# EAGLE design tivac-shield-communication (EAGLE 9.5.2)
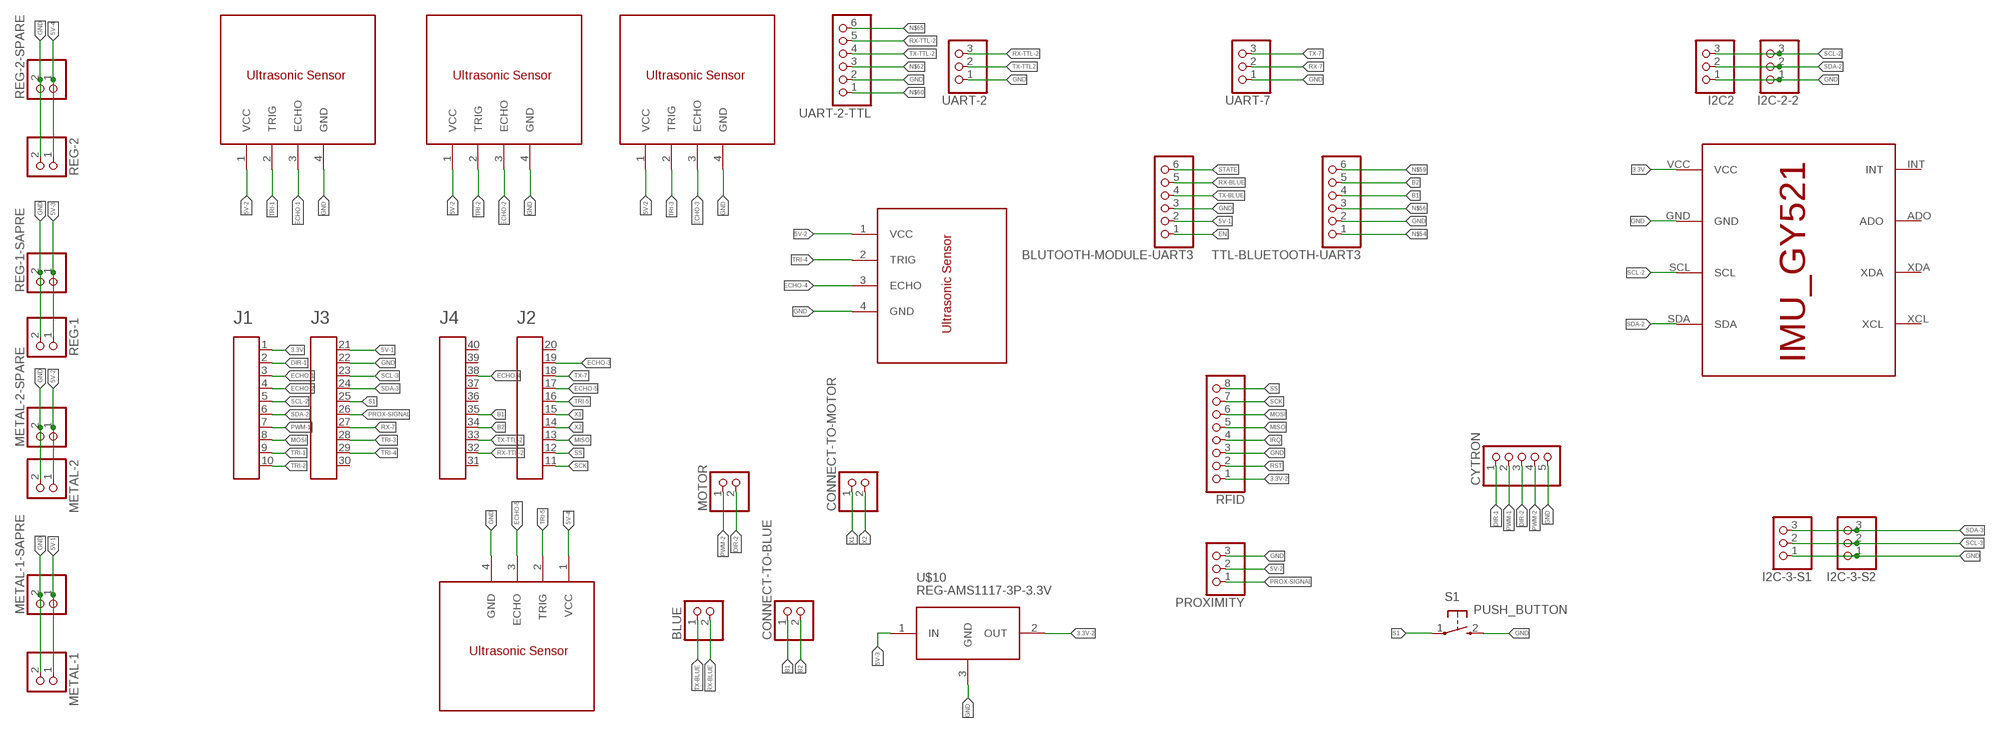
[diagram p0: schematic, sheet 1]

## Parts
A1  HEADER4X10-BOOSTERPACK  [4X10-BOOSTERPACK]
BLUE  PINHD-2_DATA  [1X02_DATA]
BLUTOOTH-MODULE-UART3  PINHD-1X6  [1X06]
CONNECT-TO-BLUE  PINHD-2_DATA  [1X02_DATA]
CONNECT-TO-MOTOR  PINHD-2_DATA  [1X02_DATA]
CYTRON  PINHD-5_DATA  [1X05_DATA]
I2C2  PINHD-1X3  [1X03]
I2C-2-2  PINHD-1X3  [1X03]
I2C-3-S1  PINHD-1X3  [1X03]
I2C-3-S2  PINHD-1X3  [1X03]
METAL-1  PINHD-1X2  [1X02]
METAL-1-SAPRE  PINHD-1X2  [1X02]
METAL-2  PINHD-1X2  [1X02]
METAL-2-SPARE  PINHD-1X2  [1X02]
MOTOR  PINHD-2_DATA  [1X02_DATA]
PROXIMITY  PINHD-1X3  [1X03]
REG-1  PINHD-1X2  [1X02]
REG-1-SAPRE  PINHD-1X2  [1X02]
REG-2  PINHD-1X2  [1X02]
REG-2-SPARE  PINHD-1X2  [1X02]
RFID  PINHD-1X8  [1X08]
S1  PUSH_BUTTON  [B3F-10XX]
TTL-BLUETOOTH-UART3  PINHD-6_DATA  [1X06_DATA]
U$1  ULTRASONIC_SENSOR  [1X04]
U$2  ULTRASONIC_SENSOR  [1X04]
U$3  ULTRASONIC_SENSOR  [1X04]
U$5  ULTRASONIC_SENSOR  [1X04]
U$7  ULTRASONIC_SENSOR  [1X04]
U$9  IMU_ROBOCON  [IMU_GY521]
U$10  REG-AMS1117-3P-3.3V  [REG-AMS1117-3P]
UART-2  PINHD-1X3  [1X03]
UART-2-TTL  PINHD-6_DATA  [1X06_DATA]
UART-7  PINHD-1X3  [1X03]

## Nets
3.3V: A1.1 U$9.VCC
3.3V-2: RFID.1 U$10.2(OUT)
5V-1: A1.21 BLUTOOTH-MODULE-UART3.2 METAL-1-SAPRE.1 METAL-1.1
5V-2: METAL-2-SPARE.1 METAL-2.1 PROXIMITY.2 U$1.1(VCC) U$2.1(VCC) U$3.1(VCC) U$7.1(VCC)
5V-3: REG-1-SAPRE.1 REG-1.1 U$10.1(IN)
5V-4: REG-2-SPARE.1 REG-2.1 U$5.1(VCC)
B1: A1.35 CONNECT-TO-BLUE.1 TTL-BLUETOOTH-UART3.4
B2: A1.34 CONNECT-TO-BLUE.2 TTL-BLUETOOTH-UART3.5
DIR-1: A1.2 CYTRON.1
DIR-2: CYTRON.3 MOTOR.2
ECHO-1: A1.3 U$1.3(ECHO)
ECHO-2: A1.4 U$2.3(ECHO)
ECHO-3: A1.19 U$3.3(ECHO)
ECHO-4: A1.38 U$7.3(ECHO)
ECHO-5: A1.17 U$5.3(ECHO)
EN: BLUTOOTH-MODULE-UART3.1
GND: A1.22 BLUTOOTH-MODULE-UART3.3 CYTRON.5 I2C2.1 I2C-2-2.1 I2C-3-S1.1 I2C-3-S2.1 METAL-1-SAPRE.2 METAL-1.2 METAL-2-SPARE.2 METAL-2.2 PROXIMITY.3 REG-1-SAPRE.2 REG-1.2 REG-2-SPARE.2 REG-2.2 RFID.3 S1.2(S) TTL-BLUETOOTH-UART3.2 U$1.4(GND) U$2.4(GND) U$3.4(GND) U$5.4(GND) U$7.4(GND) U$9.GND U$10.3(GND) UART-2-TTL.2 UART-2.1 UART-7.1
IRQ: RFID.4
MISO: A1.13 RFID.5
MOSI: A1.8 RFID.6
N$54: TTL-BLUETOOTH-UART3.1
N$56: TTL-BLUETOOTH-UART3.3
N$59: TTL-BLUETOOTH-UART3.6
N$60: UART-2-TTL.1
N$62: UART-2-TTL.3
N$65: UART-2-TTL.6
PROX-SIGNAL: A1.26 PROXIMITY.1
PWM-1: A1.7 CYTRON.2
PWM-2: CYTRON.4 MOTOR.1
RST: RFID.2
RX-7: A1.27 UART-7.2
RX-BLUE: BLUE.2 BLUTOOTH-MODULE-UART3.5
RX-TTL-2: A1.32 UART-2-TTL.5 UART-2.3
S1: A1.25 S1.1(P)
SCK: A1.11 RFID.7
SCL-2: A1.5 I2C2.3 I2C-2-2.3 U$9.SCL
SCL-3: A1.23 I2C-3-S1.2 I2C-3-S2.2
SDA-2: A1.6 I2C2.2 I2C-2-2.2 U$9.SDA
SDA-3: A1.24 I2C-3-S1.3 I2C-3-S2.3
SS: A1.12 RFID.8
STATE: BLUTOOTH-MODULE-UART3.6
TRI-1: A1.9 U$1.2(TRIG)
TRI-2: A1.10 U$2.2(TRIG)
TRI-3: A1.28 U$3.2(TRIG)
TRI-4: A1.29 U$7.2(TRIG)
TRI-5: A1.16 U$5.2(TRIG)
TX-7: A1.18 UART-7.3
TX-BLUE: BLUE.1 BLUTOOTH-MODULE-UART3.4
TX-TTL2: UART-2.2
TX-TTL-2: A1.33 UART-2-TTL.4
X1: A1.15 CONNECT-TO-MOTOR.1
X2: A1.14 CONNECT-TO-MOTOR.2
Unconnected: A1.20 A1.30 A1.31 A1.36 A1.37 A1.39 A1.40 U$9.ADO U$9.INT U$9.XCL U$9.XDA

## Library data of the parts
A1 = EAGLE_BoosterPack_Library:HEADER4X10-BOOSTERPACK
BLUE CONNECT-TO-BLUE CONNECT-TO-MOTOR MOTOR = MIA_LIBRARY-2-2-2 (1):PINHD-2_DATA: PIN HEADER
BLUTOOTH-MODULE-UART3 = MIA_LIBRARY-2-2-2 (1):PINHD-1X6: PIN HEADER
CYTRON = MIA_LIBRARY-2-2-2 (1):PINHD-5_DATA: PIN HEADER
I2C2 I2C-2-2 I2C-3-S1 I2C-3-S2 PROXIMITY UART-2 UART-7 = MIA_LIBRARY-2-2-2 (1):PINHD-1X3: PIN HEADER
METAL-1 METAL-1-SAPRE METAL-2 METAL-2-SPARE REG-1 REG-1-SAPRE REG-2 REG-2-SPARE = MIA_LIBRARY-2-2-2 (1):PINHD-1X2: PIN HEADER
RFID = MIA_LIBRARY-2-2-2 (1):PINHD-1X8: PIN HEADER
S1 = MIA_LIBRARY-2-2-2 (1):PUSH_BUTTON: OMRON SWITCH
TTL-BLUETOOTH-UART3 UART-2-TTL = MIA_LIBRARY-2-2-2 (1):PINHD-6_DATA: PIN HEADER
U$1-U$3 U$5 U$7 = MIA_LIBRARY-2-2-2 (1):ULTRASONIC_SENSOR
U$9 = MIA_LIBRARY-2-2-2 (1):IMU_ROBOCON
U$10 = MIA_LIBRARY-2-2-2 (1):REG-AMS1117-3P-*: Linear Regulator based on AMS1117 chip 3-pin version AMS1117 datasheet is available here: http://www.advanced-monolithic.com/pdf/ds1117.pdf Click here to find device on ebay.com <http://www.ebay.com/sch/ams1117+module> Note: There are many variants. Search for the proper version.

## Board
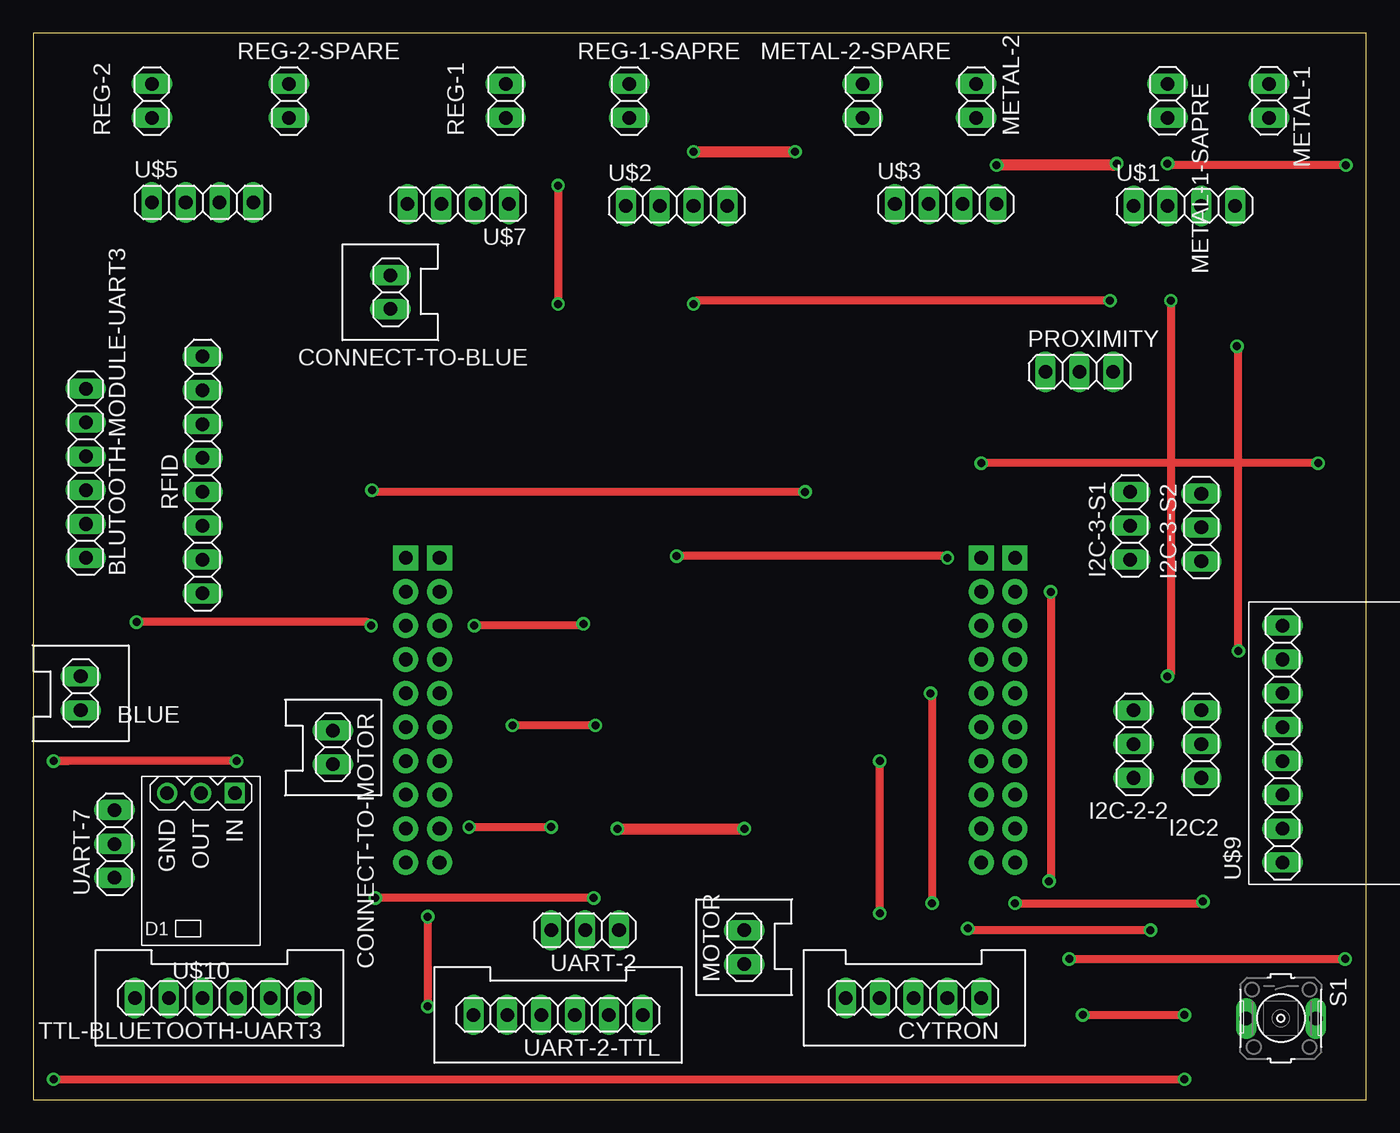
[diagram p1: board, top side]
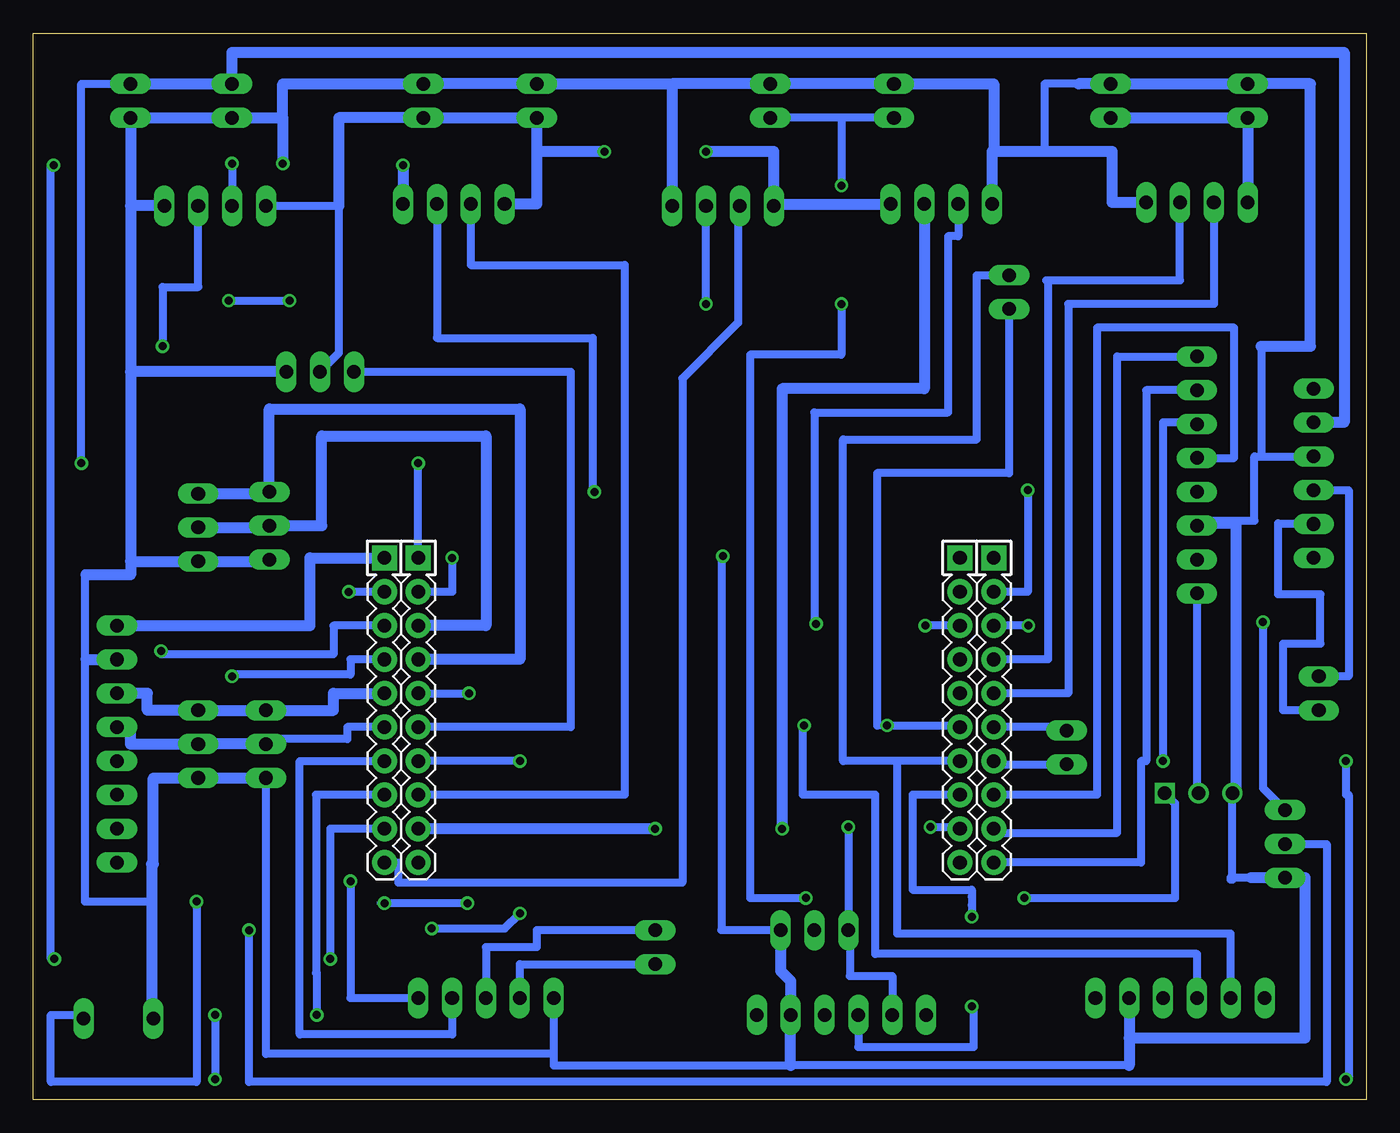
[diagram p2: board, bottom side, seen from below]

Size 100 x 80 mm. Coordinates in mm from the lower left corner, seen from the top.
Outline: 0,0 100,0 100,80 0,80 0,0
Copper layers (1*16): Top 0.035mm / dielectric 1.5mm / Bottom 0.035mm
Design rules "default": minimum track width 6mil, minimum drill 0.35mm, track to track 6mil, track to pad 6mil, pad to pad 6mil, via to via 6mil, smd to smd 6mil, copper to edge 40mil, drill to drill 6mil, minimum pad ring 10mil, minimum via ring 8mil, stop-mask expansion 4mil, vias tented up to drill 0mil, thermal gap 10mil

### Footprints (pad centres in the part's own frame; a part is rotated, then mirrored left to right if it is on the bottom)
4X10-BOOSTERPACK = drill 1.016 pad 1.88 square: 1 0,10.16; 20 45.72,10.16; 21 2.54,10.16; 40 43.18,10.16 | drill 1.016 pad 1.88: 2 0,7.62; 3 0,5.08; 4 0,2.54; 5 0,0; 6 0,-2.54; 7 0,-5.08; 8 0,-7.62; 9 0,-10.16; 10 0,-12.7; 11 45.72,-12.7; 12 45.72,-10.16; 13 45.72,-7.62; 14 45.72,-5.08; 15 45.72,-2.54; 16 45.72,0; 17 45.72,2.54; 18 45.72,5.08; 19 45.72,7.62; 22 2.54,7.62; 23 2.54,5.08; 24 2.54,2.54; 25 2.54,0; 26 2.54,-2.54; 27 2.54,-5.08; 28 2.54,-7.62; 29 2.54,-10.16; 30 2.54,-12.7; 31 43.18,-12.7; 32 43.18,-10.16; 33 43.18,-7.62; 34 43.18,-5.08; 35 43.18,-2.54; 36 43.18,0; 37 43.18,2.54; 38 43.18,5.08; 39 43.18,7.62
1X02_DATA = drill 1.016 long: 1 -1.27,0; 2 1.27,0
1X06 = drill 1.016 long: 1 -6.35,0; 2 -3.81,0; 3 -1.27,0; 4 1.27,0; 5 3.81,0; 6 6.35,0
1X05_DATA = drill 1.016 long: 1 -5.08,0; 2 -2.54,0; 3 0,0; 4 2.54,0; 5 5.08,0
1X03 = drill 1.016 long: 1 -2.54,0; 2 0,0; 3 2.54,0
1X02 = drill 1.016 long: 1 -1.27,0; 2 1.27,0
1X08 = drill 1.016 long: 1 -8.89,0; 2 -6.35,0; 3 -3.81,0; 4 -1.27,0; 5 1.27,0; 6 3.81,0; 7 6.35,0; 8 8.89,0
B3F-10XX = drill 1.016 long: 1 0.013,2.636; 2 0.029,-2.605
1X06_DATA = drill 1.016 long: 1 -6.35,0; 2 -3.81,0; 3 -1.27,0; 4 1.27,0; 5 3.81,0; 6 6.35,0
1X04 = drill 1.016 long: 1 -3.81,0; 2 -1.27,0; 3 1.27,0; 4 3.81,0
IMU_GY521 = drill 1.016 long: ADO -6.35,0; GND 6.35,0; INT -8.89,0; SCL 3.81,0; SDA 1.27,0; VCC 8.89,0; XCL -3.81,0; XDA -1.27,0
REG-AMS1117-3P = drill 1 square: 1 -2.54,-5.08 | drill 1: 2 0,-5.08; 3 2.54,-5.08

### Placement (x,y rotation side)
A1  73.66,30.48 0 bottom
BLUE  3.56,30.48 270 top
BLUTOOTH-MODULE-UART3  3.94,46.99 270 top
CONNECT-TO-BLUE  26.8,60.58 90 top
CONNECT-TO-MOTOR  22.48,26.42 270 top
CYTRON  66.04,7.62 180 top
I2C2  87.63,26.67 90 top
I2C-2-2  82.55,26.67 90 top
I2C-3-S1  82.3,43.05 90 top
I2C-3-S2  87.63,42.93 90 top
METAL-1  92.71,74.93 270 top
METAL-1-SAPRE  85.09,74.93 270 top
METAL-2  70.74,74.93 90 top
METAL-2-SPARE  62.23,74.93 90 top
MOTOR  53.34,11.43 90 top
PROXIMITY  78.49,54.61 0 top
REG-1  35.43,74.93 90 top
REG-1-SAPRE  44.7,74.93 90 top
REG-2  8.89,74.93 90 top
REG-2-SPARE  19.18,74.93 90 top
RFID  12.7,46.86 90 top
S1  93.6,6.1 270 top
TTL-BLUETOOTH-UART3  13.97,7.62 180 top
U$1  86.36,67.06 0 top
U$2  48.26,67.06 0 top
U$3  68.45,67.18 0 top
U$5  12.7,67.31 0 top
U$7  31.88,67.18 180 top
U$9  93.73,26.67 90 top
U$10  12.57,17.91 180 top
UART-2  41.4,12.7 180 top
UART-2-TTL  39.37,6.35 180 top
UART-7  6.1,19.18 90 top

### Tracks (layer width: path | path; a pad name or v marks a point on that pad's centre or on a via)
3.3V
  Bottom 0.813: U$9.VCC 79.25,35.56 79.25,40.64 A1.1
3.3V-2
  Bottom 0.61: RFID.1 12.7,23.11 U$10.2
5V-1  (via drill 0.6)
  Top 0.61: v96.39,47.75 v71.12,47.75
  Bottom 0.61: A1.21 v71.12,47.75 | v96.39,47.75 96.39,76.2 METAL-1.1
  Bottom 0.813: METAL-1.1 METAL-1-SAPRE.1 85.09,78.58 1.65,78.58 1.65,50.8 BLUTOOTH-MODULE-UART3.2
5V-2  (via drill 0.6)
  Top 0.813: v49.53,71.12 v57.15,71.12
  Bottom 0.61: PROXIMITY.2 77.09,56.01 77.09,67.06 U$1.1
  Bottom 0.813: 77.09,67.06 77.09,73.66 METAL-2.1 METAL-2-SPARE.1 62.23,71.12 | 62.23,71.12 62.23,67.18 U$3.1 | U$7.1 44.32,67.18 U$2.1 44.45,71.12 v49.53,71.12 | v57.15,71.12 62.23,71.12
5V-3  (via drill 0.6)
  Top 0.61: v39.37,68.58 v39.37,59.69 | v42.04,15.11 v25.65,15.11
  Bottom 0.61: REG-1-SAPRE.1 REG-1.1 39.37,73.66 v39.37,68.58 | v42.04,15.11 46.23,15.11 46.23,55.88 39.37,55.88 v39.37,59.69 | v25.65,15.11 14.35,15.11 14.35,22.23 U$10.1
5V-4
  Bottom 0.813: REG-2-SPARE.1 REG-2.1 U$5.1
B1  (via drill 0.6)
  Top 0.61: v42.16,28.07 v35.94,28.07
  Bottom 0.61: CONNECT-TO-BLUE.1 26.8,46.99 36.7,46.99 36.7,28.07 v35.94,28.07 30.61,28.07 A1.35 | TTL-BLUETOOTH-UART3.4 12.7,10.92 36.83,10.92 36.83,22.86 42.29,22.86 42.29,27.94 v42.16,28.07
B2
  Bottom 0.61: A1.34 35.18,25.4 | 35.18,25.4 39.24,25.4 39.24,49.53 29.21,49.53 29.21,61.85 CONNECT-TO-BLUE.2 | TTL-BLUETOOTH-UART3.5 10.16,12.45 35.18,12.45 35.18,25.4
DIR-1  (via drill 0.6)
  Top 0.61: v76.33,38.1 76.33,16.51 76.2,16.51 v76.2,16.38
  Bottom 0.61: A1.2 v76.33,38.1 | v76.2,16.38 76.2,7.62 CYTRON.1
DIR-2
  Bottom 0.61: MOTOR.2 62.23,12.7 62.23,11.43 66.04,11.43 CYTRON.3
ECHO-1  (via drill 0.6)
  Top 0.61: v90.42,33.66 90.42,56.52 v90.3,56.52
  Bottom 0.61: U$1.3 87.63,60.96 90.3,60.96 v90.3,56.52 | A1.3 77.47,35.56 77.47,33.4 90.42,33.4 v90.42,33.66
ECHO-2  (via drill 0.6)
  Top 0.61: v85.34,59.94 85.34,32 v85.09,31.75 | v80.77,59.94 49.78,59.94 v49.53,59.69
  Bottom 0.61: A1.4 76.2,33.02 76.2,31.88 85.09,31.88 v85.09,31.75 | v85.34,59.94 v80.77,59.94 | v49.53,59.69 U$2.3
ECHO-3  (via drill 0.6)
  Top 0.61: v57.91,45.59 25.53,45.59 v25.4,45.72
  Bottom 0.61: U$3.3 69.72,57.15 58.04,57.15 58.04,45.72 v57.91,45.59 | v25.4,45.72 25.4,38.1 A1.19
ECHO-4  (via drill 0.6)
  Top 0.61: v33.08,35.56 41.27,35.56 v41.27,35.69
  Bottom 0.61: U$7.3 30.61,64.77 31.37,64.77 31.37,51.56 41.4,51.56 41.4,35.81 v41.27,35.69 | A1.38 v33.08,35.56
ECHO-5
  Bottom 0.61: 24,61.47 23.88,61.47 | 23.88,61.47 13.97,61.47 U$5.3 | 23.88,61.47 23.88,33.02 A1.17
GND  (via drill 0.6)
  Top 0.61: v68.58,40.64 68.45,40.77 v48.26,40.77
  Top 0.813: v81.28,70.23 81.15,70.23 81.03,70.1 v72.26,70.1
  Bottom 0.61: 96.04,39.37 96.14,39.47 96.14,33.02 96.04,33.02 96.14,32.92 96.14,14.86 91.12,14.86 | 91.12,17.65 90.99,17.65 | 7.87,48.26 8.38,48.26 8.38,43.43 12.32,43.43 RFID.3 | 7.87,48.26 BLUTOOTH-MODULE-UART3.3 | CYTRON.5 60.96,3.43 | 60.96,3.43 60.96,2.56 43.18,2.56 17.78,2.56 | 7.87,56.52 7.87,48.26 | 60.96,3.43 82.55,3.43 I2C-2-2.1 | UART-2.1 48.39,12.7 48.39,40.64 v48.26,40.77 | v68.58,40.64 68.58,38.1 A1.22 | 21.59,76.2 24.13,76.2 24.13,71.12 | 8.64,16.64 10.16,16.64 10.16,16.51 10.03,16.51 U$10.3
  Bottom 0.813: 21.59,76.2 REG-2-SPARE.2 REG-2.2 4.19,76.2 4.19,56.52 7.87,56.52 | U$5.4 19.05,67.31 19.05,71.12 24.13,71.12 27.94,71.12 | 27.94,71.12 28.07,71.12 U$7.4 | 27.94,71.12 27.94,76.2 REG-1.2 REG-1-SAPRE.2 52.07,76.2 | 52.07,76.2 U$2.4 | 52.07,76.2 METAL-2-SPARE.2 METAL-2.2 81.28,76.2 81.28,73.66 | METAL-1-SAPRE.2 84.45,73.66 | METAL-1-SAPRE.2 METAL-1.2 92.71,67.06 | I2C-2-2.1 I2C2.1 90.99,24.13 90.99,17.65 | 91.12,17.65 91.12,14.86 91.12,6.19 S1.2 | 96.04,33.02 U$9.GND | I2C-3-S1.1 82.42,40.39 I2C-3-S2.1 | I2C-3-S2.1 87.76,40.39 | 92.71,40.39 I2C-3-S2.1 | 96.04,39.37 92.71,39.37 92.71,40.39 | 92.71,54.61 92.71,40.39 | PROXIMITY.3 92.71,54.61 | U$1.4 92.71,67.06 | 92.71,67.06 92.71,54.61 | UART-2.1 43.94,9.65 43.18,8.89 UART-2-TTL.2 43.18,2.56 | TTL-BLUETOOTH-UART3.2 17.78,4.6 | 17.78,4.6 17.78,2.56 | 17.78,4.6 4.6,4.6 4.6,16.64 UART-7.1 8.64,16.64 | v72.26,70.1 U$3.4 | 81.28,73.66 v81.28,70.23 | METAL-1-SAPRE.2 81.28,73.66 | U$10.3 9.78,22.99 9.78,43.27 12.49,43.27 RFID.3
MISO
  Bottom 0.61: RFID.5 9.91,48.13 9.91,57.91 20.19,57.91 20.19,22.86 A1.13
MOSI  (via drill 0.6)
  Top 0.61: v78.74,6.35 v86.36,6.35 | 2.59,25.4 v1.52,25.4 v15.24,25.4 | v1.52,1.52 v86.36,1.52
  Bottom 0.61: v78.74,6.35 78.74,9.48 78.79,9.48 78.79,22.86 A1.8 | v86.36,6.35 v86.36,1.52 86.36,1.32 | RFID.6 12.7,50.8 15.24,50.8 v15.24,25.4 | v1.52,25.4 1.52,22.86 1.32,22.86 1.32,1.52 v1.52,1.52
PROX-SIGNAL
  Bottom 0.61: PROXIMITY.1 59.69,54.61 59.69,27.94 A1.26
PWM-1
  Bottom 0.61: CYTRON.2 68.58,4.88 80.01,4.88 80.01,25.4 A1.7
PWM-2
  Bottom 0.61: CYTRON.4 63.5,10.16 MOTOR.1
RX-7  (via drill 0.6)
  Top 0.61: v83.82,12.7 70.23,12.7 v70.1,12.83 | v63.5,13.97 v63.5,25.4
  Bottom 0.61: UART-7.2 2.97,19.18 2.97,1.32 83.82,1.32 v83.82,12.7 | v70.1,12.83 64.64,12.83 v63.5,13.97 | v63.5,25.4 A1.27
RX-BLUE
  Bottom 0.61: BLUTOOTH-MODULE-UART3.5 3.99,43.23 6.63,43.23 6.63,37.92 3.43,37.92 3.43,34.21 6.22,34.21 6.22,29.21 BLUE.2
RX-TTL-2  (via drill 0.6)
  Top 0.61: v32.7,20.45 v38.86,20.45
  Bottom 0.61: UART-2-TTL.5 35.56,9.27 38.73,9.27 38.73,12.57 UART-2.3 v38.86,20.45 | v32.7,20.45 30.61,20.45 A1.32
S1  (via drill 0.6)
  Top 0.61: v67.31,30.48 67.44,30.35 v67.44,14.73 | v87.76,14.86 87.76,14.73 v73.66,14.73
  Bottom 0.61: A1.25 v67.31,30.48 | v67.44,14.73 v73.66,14.73 73.91,14.73 | v87.76,14.86 87.76,1.32 98.68,1.32 98.68,6.35 96.23,6.35 S1.1
SCK
  Bottom 0.61: RFID.7 16.51,53.21 16.51,25.4 16.89,25.4 16.89,17.78 A1.11
SCL-2
  Bottom 0.813: U$9.SCL 91.44,30.48 91.44,29.21 I2C2.3 I2C-2-2.3 77.47,29.21 77.47,30.48 A1.5
SCL-3
  Bottom 0.813: I2C-3-S2.2 82.42,42.93 I2C-3-S1.2 78.36,43.05 78.36,49.78 66.04,49.78 66.04,35.56 A1.23
SDA-2
  Bottom 0.61: I2C-2-2.2 82.93,26.67 82.93,27.05 76.45,27.05 76.45,27.94 A1.6
  Bottom 0.813: U$9.SDA 92.71,27.94 92.71,26.67 I2C2.2 I2C-2-2.2
SDA-3
  Bottom 0.813: I2C-3-S2.3 82.42,45.47 I2C-3-S1.3 82.3,51.82 63.5,51.82 63.5,33.02 A1.24
SS
  Bottom 0.61: A1.12 27.64,20.02 18.67,20.02 18.67,55.75 RFID.8
TRI-1  (via drill 0.6)
  Top 0.61: v77.72,10.54 v98.42,10.54 | v98.48,70.1 85.22,70.1 v85.09,70.23
  Bottom 0.61: A1.9 77.72,20.32 v77.72,10.54 | v98.42,10.54 98.68,10.54 98.68,70.1 v98.48,70.1 | v85.09,70.23 U$1.2
TRI-2
  Bottom 0.61: A1.10 72.62,17.78 72.62,16.28 51.31,16.28 51.31,54.1 47.12,58.29 47.12,66.93 U$2.2
TRI-3
  Bottom 0.61: U$3.2 67.18,62.61 55.63,62.61 55.63,22.86 A1.28
TRI-4  (via drill 0.6)
  Top 0.813: v43.81,20.32 v53.34,20.32
  Bottom 0.813: U$7.2 33.15,53.34 43.81,53.34 v43.81,20.32 | v53.34,20.32 A1.29
TRI-5
  Bottom 0.61: A1.16 22.35,30.48 22.35,59.69 11.43,59.69 U$5.2
TX-7  (via drill 0.6)
  Top 0.61: v25.34,35.56 25.09,35.81 v7.75,35.81
  Bottom 0.61: v7.75,35.81 7.75,23.37 UART-7.3 | v25.34,35.56 A1.18
TX-BLUE
  Bottom 0.61: BLUTOOTH-MODULE-UART3.4 1.32,45.72 1.32,31.75 BLUE.1
TX-TTL-2  (via drill 0.6)
  Top 0.61: v29.59,13.72 v29.59,6.99
  Bottom 0.61: UART-2-TTL.4 38.1,3.94 29.46,3.94 29.46,6.99 v29.59,6.99 | A1.33 34.04,22.86 34.04,15.75 29.59,15.75 29.59,15.24 29.59,14.61 v29.59,13.72
X1
  Bottom 0.61: CONNECT-TO-MOTOR.1 22.48,27.94 A1.15
X2
  Bottom 0.61: A1.14 27.94,25.15 CONNECT-TO-MOTOR.2